# Altium schematic sheet 03_MCU部分.SchDoc
size A4; DocumentNumber: 3; SheetNumber: 3; SheetTotal: 4
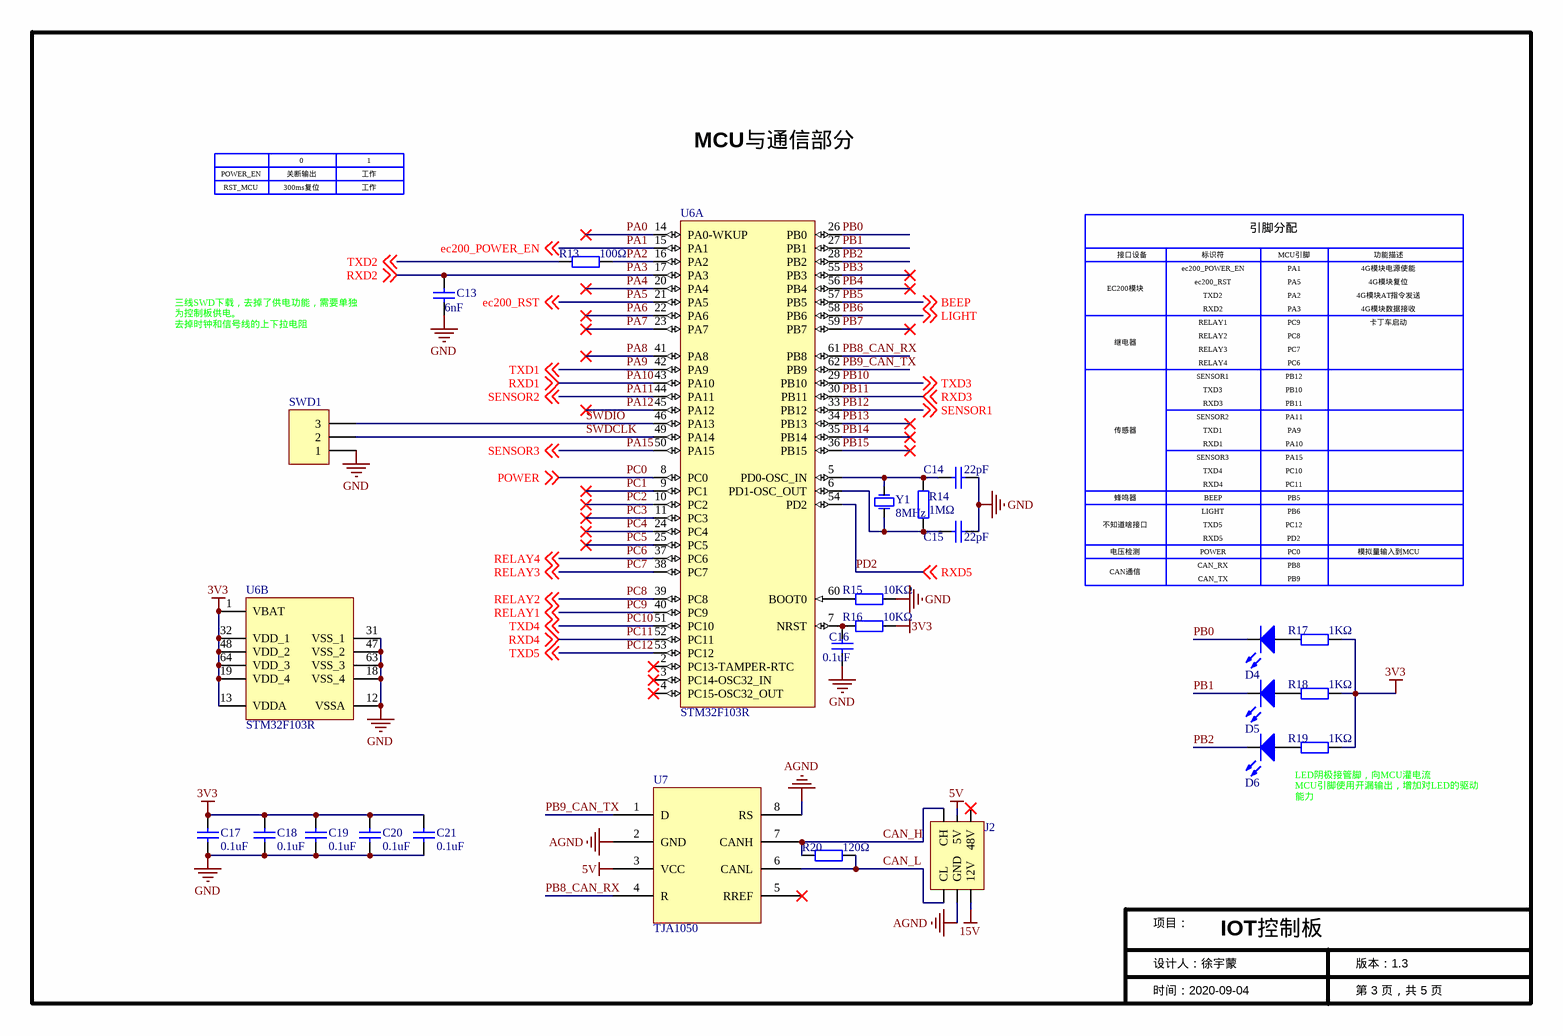
[diagram p0: 03_MCU部分.SchDoc]

## Parts
C13  value 6nF  [CAP-0603]  (hidden comment: Cap)
C14  value 22pF  [CAP-0603]  (hidden comment: Cap)
C15  value 22pF  [CAP-0603]  (hidden comment: Cap)
C16  value 0.1uF  [CAP-0603]  (hidden comment: Cap)
C17  value 0.1uF  [CAP-0603]  (hidden comment: Cap)
C18  value 0.1uF  [CAP-0603]  (hidden comment: Cap)
C19  value 0.1uF  [CAP-0603]  (hidden comment: Cap)
C20  value 0.1uF  [CAP-0603]  (hidden comment: Cap)
C21  value 0.1uF  [CAP-0603]  (hidden comment: Cap)
D4  LED  [LED_0805]  (value not drawn)
D5  LED  [LED_0805]  (value not drawn)
D6  LED  [LED_0805]  (value not drawn)
J2  标准接口  [标准接口-直插-灰色]  (value not drawn)
R13  value 100Ω  [0603]  (hidden comment: Res)
R14  value 1MΩ  [0603]  (hidden comment: Res)
R15  value 10KΩ  [0603]  (hidden comment: Res)
R16  value 10KΩ  [0603]  (hidden comment: Res)
R17  value 1KΩ  [0603]  (hidden comment: Res)
R18  value 1KΩ  [0603]  (hidden comment: Res)
R19  value 1KΩ  [0603]  (hidden comment: Res)
R20  value 120Ω  [0603]  (hidden comment: Res)
SWD1  Header3  [Header_3X1_2.54_排针]  (value not drawn)
U6  STM32F103R  [LQFP64]  (parts A,B of 2)
U7  TJA1050  [TJA1050]
Y1  value 8MHz  [X-SM49]  (hidden comment: XTAL)

## Nets
3V3: C17.2 C18.2 C19.2 C20.2 C21.2 R16.1 R17.1 R18.1 R19.1 U6.1(VBAT) U6.13(VDDA) U6.19(VDD_4) U6.32(VDD_1) U6.48(VDD_2) U6.64(VDD_3)
5V: J2.3(5V) U7.3(VCC)
15V: J2.2(12V)
AGND: J2.4(GND) U7.2(GND) U7.8(RS)
GND: C13.2 C14.1 C15.1 C16.1 C17.1 C18.1 C19.1 C20.1 C21.1 R15.1 SWD1.1 U6.12(VSSA) U6.18(VSS_4) U6.31(VSS_1) U6.47(VSS_2) U6.63(VSS_3)
CAN_H: J2.5(CH) R20.2 U7.7(CANH)
CAN_L: J2.6(CL) R20.1 U7.6(CANL)
PA0: U6.14(PA0-WKUP)
PA1: U6.15(PA1) ; off-sheet ec200_POWER_EN  [also labelled ec200_POWER_EN]
PA2: R13.1 U6.16(PA2)
PA3: C13.1 U6.17(PA3) ; off-sheet RXD2  [also labelled RXD2]
PA4: U6.20(PA4)
PA5: U6.21(PA5) ; off-sheet ec200_RST  [also labelled ec200_RST]
PA6: U6.22(PA6)
PA7: U6.23(PA7)
PA8: U6.41(PA8)
PA9: U6.42(PA9) ; off-sheet TXD1  [also labelled TXD1]
PA10: U6.43(PA10) ; off-sheet RXD1  [also labelled RXD1]
PA11: U6.44(PA11) ; off-sheet SENSOR2  [also labelled SENSOR2]
PA12: U6.45(PA12)
PA15: U6.50(PA15) ; off-sheet SENSOR3  [also labelled SENSOR3]
PB0: D4.2(K) U6.26(PB0)
PB1: D5.2(K) U6.27(PB1)
PB2: D6.2(K) U6.28(PB2)
PB3: U6.55(PB3)
PB4: U6.56(PB4)
PB5: U6.57(PB5) ; off-sheet BEEP  [also labelled BEEP]
PB6: U6.58(PB6) ; off-sheet LIGHT  [also labelled LIGHT]
PB7: U6.59(PB7)
PB8_CAN_RX: U6.61(PB8) U7.4(R)
PB9_CAN_TX: U6.62(PB9) U7.1(D)
PB10: U6.29(PB10) ; off-sheet TXD3  [also labelled TXD3]
PB11: U6.30(PB11) ; off-sheet RXD3  [also labelled RXD3]
PB12: U6.33(PB12) ; off-sheet SENSOR1  [also labelled SENSOR1]
PB13: U6.34(PB13)
PB14: U6.35(PB14)
PB15: U6.36(PB15)
PC0: U6.8(PC0) ; off-sheet POWER  [also labelled POWER]
PC1: U6.9(PC1)
PC2: U6.10(PC2)
PC3: U6.11(PC3)
PC4: U6.24(PC4)
PC5: U6.25(PC5)
PC6: U6.37(PC6) ; off-sheet RELAY4  [also labelled RELAY4]
PC7: U6.38(PC7) ; off-sheet RELAY3  [also labelled RELAY3]
PC8: U6.39(PC8) ; off-sheet RELAY2  [also labelled RELAY2]
PC9: U6.40(PC9) ; off-sheet RELAY1  [also labelled RELAY1]
PC10: U6.51(PC10) ; off-sheet TXD4  [also labelled TXD4]
PC11: U6.52(PC11) ; off-sheet RXD4  [also labelled RXD4]
PC12: U6.53(PC12) ; off-sheet TXD5  [also labelled TXD5]
PD2: U6.54(PD2) ; off-sheet RXD5  [also labelled RXD5]
SWDCLK: SWD1.2 U6.49(PA14)
SWDIO: SWD1.3 U6.46(PA13)
TXD2: R13.2 ; off-sheet TXD2
NetC14_2: C14.2 R14.2 U6.5(PD0-OSC_IN) Y1.2
NetC15_2: C15.2 R14.1 U6.6(PD1-OSC_OUT) Y1.1
NetC16_2: C16.2 R16.2 U6.7(NRST)
NetD4_1: D4.1(A) R17.2
NetD5_1: D5.1(A) R18.2
NetD6_1: D6.1(A) R19.2
NetR15_2: R15.2 U6.60(BOOT0)

Not connected (* = marked no-connect by the designer): J2 1(48V)*; U6 2(PC13-TAMPER-RTC)* 3(PC14-OSC32_IN)* 4(PC15-OSC32_OUT)*; U7 5(RREF)*

## Notes on the sheet
- POWER_EN
- 0
- 关断输出
- 1
- 工作
- MCU与通信部分
- RST_MCU
- 300ms复位
- 接口设备
- 标识符
- 引脚分配
- MCU引脚
- 功能描述
- EC200模块
- ec200_POWER_EN
- ec200_RST
- TXD2
- RXD2
- PA1
- PA5
- PA2
- PA3
- 4G模块电源使能
- 4G模块复位
- 4G模块AT指令发送
- 4G模块数据接收
- 三线SWD下载，去掉了供电功能，需要单独为控制板供电。
  去掉时钟和信号线的上下拉电阻
- 继电器
- RELAY1
- RELAY2
- RELAY3
- RELAY4
- SENSOR1
- TXD3
- PB10
- PB12
- PC6
- PC7
- PC8
- PC9
- 卡丁车启动
- 传感器
- RXD3
- SENSOR2
- TXD1
- RXD1
- PB11
- PA9
- PA10
- PA11
- 蜂鸣器
- 不知道啥接口
- SENSOR3
- BEEP
- LIGHT
- TXD5
- TXD4
- RXD4
- PC12
- PC10
- PC11
- PA15
- PB6
- PB5
- 电压检测
- CAN通信
- RXD5
- POWER
- CAN_RX
- CAN_TX
- PD2
- PC0
- PB8
- PB9
- 模拟量输入到MCU
- LED阴极接管脚，向MCU灌电流
  MCU引脚使用开漏输出，增加对LED的驱动能力
- 项目：
- IOT控制板
- 设计人：徐宇蒙
- 时间：2020-09-04
- 第 3 页，共 5 页
- 版本：1.3

## Library data of the parts
C13-C21 = Cap: 无极性电容; Published: 8-Jun-2000; LatestRevisionDate: 17-Jul-2002; LatestRevisionNote: Re-released for DXP Platform.; PackageReference: RAD-0.3; Publisher: Altium Limited
D4-D6 = LED: 发光二极管; Published: 8-Jun-2000; LatestRevisionDate: 08-Jul-2005; LatestRevisionNote: Mech Layer 1 removed.; PackageReference: LED-0; Publisher: Altium Limited
R13-R20 = Res: 贴片电阻; Published: 8-Jun-2000; LatestRevisionDate: 17-Jul-2002; LatestRevisionNote: Re-released for DXP Platform.; PackageReference: AXIAL-0.4; Publisher: Altium Limited
SWD1 = Header3: 接插件
U6 = STM32F103R: STM32单片机64引脚; PartNumber: STM32F103RGT6; A/D Converter: 3x12-bit (16 Channel); Core: ARM Cortex-M3; D/A Converter: 2x12-bit (2 Channel); FLASH Size (Prog) (kB): 1024; I/Os (High Current): 51; Internal RAM Size (kB): 96; Operating Frequency(F) (Processor speed) (MHz): 72; Packing: Tray; Supply Voltage(Vcc) min (V): 2; DatasheetVersion: Rev. 3; PackageVersion: Rev. 4, 06/2013; PackageReference: LQFP64; PackageDescription: 64-Pin Low Profile Quad Flat Package, 10 x 10 mm Body, 0.5 mm Pitch; Supplier 1: Digi-Key; Supplier Part Number 1: 497-11118-ND; Supplier 2: Farnell; Supplier Part Number 2: 2215220; Supplier 3: Newark; Supplier Part Number 3: 21T4016; Supplier 4: Mouser; Supplier Part Number 4: 511-STM32F103RGT6; Mounting Technology: Surface Mount; ComponentLink1Description: Manufacturer URL; ComponentLink1URL: http://www.st.com/web/en/home.html; ComponentLink2Description: Datasheet; ComponentLink2URL: http://www.st.com/st-web-ui/static/active/en/resource/technical/document/datasheet/CD00253742.pdf; ComponentLink3Description: Package Specification; ComponentLink3URL: http://www.st.com/st-web-ui/static/active/en/resource/technical/document/datasheet/DM00037051.pdf
U7 = TJA1050: CAN收发器芯片
Y1 = XTAL: 晶振; Published: 8-Jun-2000; LatestRevisionDate: 17-Jul-2002; LatestRevisionNote: Re-released for DXP Platform.; PackageReference: R38; Publisher: Altium Limited